# EAGLE schematic talonBreakout (EAGLE 9.4.2)
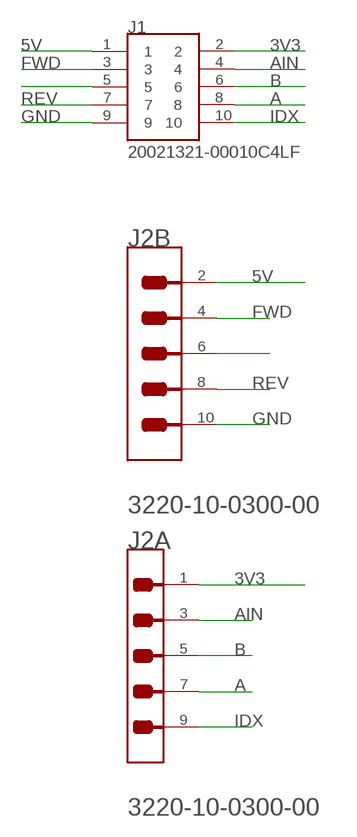
[diagram p0: schematic, sheet 1]

## Parts
J1  20021321-00010C4LF  [AMPHENOL_20021321-00010C4LF]
J2  CNC_TECH_3220-10-0300-00CNC_TECH_3220-10-0300-00_0_0  [CNC_TECH_3220-10-0300-00_0]

## Nets
3V3: J1.2 J2.1
5V: J1.1 J2.2
A: J1.8 J2.7
AIN: J1.4 J2.3
B: J1.6 J2.5
FWD: J1.3 J2.4
GND: J1.9 J2.10
IDX: J1.10 J2.9
N$1: J2.6
N$8: J1.5
REV: J1.7 J2.8

## Library data of the parts
J1 = 20021321-00010C4LF:20021321-00010C4LF: Conn; Rect; B-to-B; Receptacle; SMT; 10Pos; 1.27 x 1.27 mm; DESCRIPTION: Board-Board Connector, Header, 10 Position, 2row, Full Reel; DIGI-KEY_PART_NUMBER: 609-3706-1-ND; DIGI-KEY_PURCHASE_URL: https://www.digikey.com/product-detail/en/amphenol-icc-fci/20021321-00010C4LF/609-3706-1-ND/2209151?utm_source=snapeda&utm_medium=aggregator&utm_campaign=symbol; MF: Amphenol ICC; MP: 20021321-00010C4LF; PACKAGE: None
J2 = CNC Tech - 3220-10-0300-00:CNC_TECH_3220-10-0300-00: IDC BOX HEADER 0.050 10 POS; CENTROID_NOT_SPECIFIED: No; CONN_GENDER: Male; CONN_ORIENTATION: Straight; CONTACT_MATERIAL: Gold; CURRENT_RATING: 1A; DATASHEET: http://www.cnctech.us/pdfs/3220-XX-0300-00.pdf; DEVICE_CLASS_L1: Connectors; DEVICE_CLASS_L2: Headers and Wire Housings; DEVICE_CLASS_L3: unset; DIGIKEY_DESCRIPTION: CONN IDC BOX HEADER 0.050 10 POS; DIGIKEY_PART_NUMBER: 1175-1629-ND; HEIGHT: 5.8mm; LEAD_FREE: yes; MF: CNC Tech; MFG_PACKAGE_IDENT: 3220-10-0300-00; MFG_PACKAGE_IDENT_DATE: 0; MFG_PACKAGE_IDENT_REV: 0; MPN: 3220-10-0300-00; NUMBER_OF_CONTACTS: 10; NUMBER_OF_ROWS: 2; PACKAGE: HDR10_12MM65_5MM10; PREFIX: J; ROHS: yes; TEMPERATURE_RANGE_HIGH: +105°C; TEMPERATURE_RANGE_LOW: -40°C; VERIFICATION_VERSION: 0.0.0.1